# Altium project LW.PrjPcb
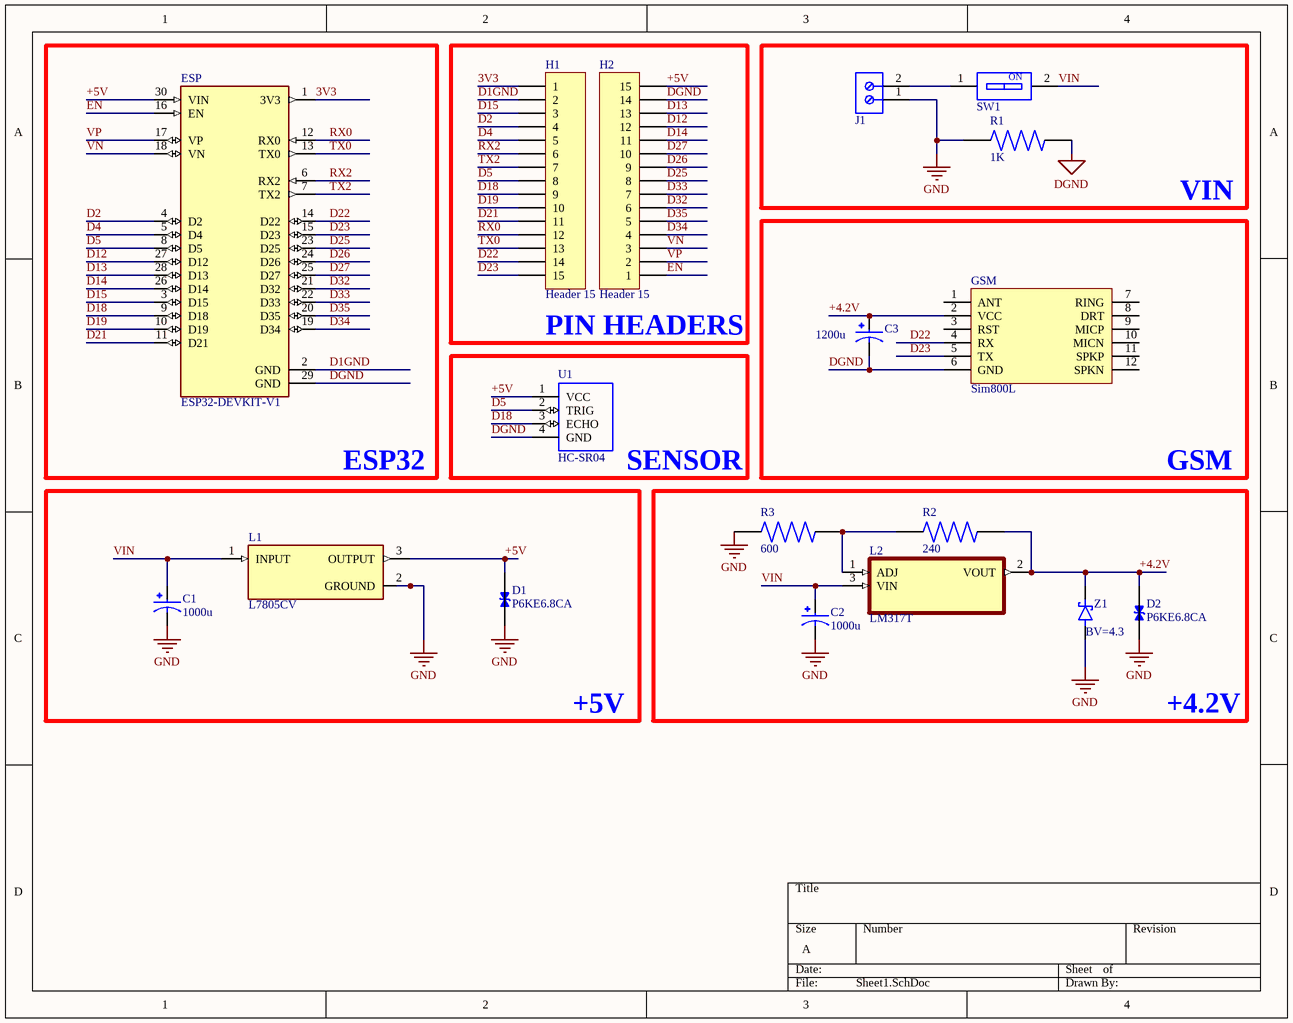
[diagram p0: Sheet1.SchDoc]
1 sheet, 18 parts. Net scope: global (net labels, ports and power ports of the same name join across sheets).
Board file: PCB1.PcbDoc

## Sheet Sheet1.SchDoc
size A; SheetNumber: 1; SheetTotal: 1

### Parts
C1  1000u  [CAPPRD500W60D1000H2000]
C2  1000u  [CAPPRD500W60D1000H2000]
C3  1200u  [CAPPRD500W60D1000H2000]
D1  P6KE6.8CA  [DIOAD1300W80L670D310]
D2  P6KE6.8CA  [DIOAD1300W80L670D310]
ESP  ESP32-DEVKIT-V1  [MODULE_ESP32_DEVKIT_V1]
GSM  Sim800L  [Sim800L]
H1  Header 15  [HDR1X15]
H2  Header 15  [HDR1X15]
J1  691101710002  [691101710002]  (value not drawn)
L1  L7805CV  [TO255P1040X460X1968-3]
L2  LM317T  [TO254P1054X470X1955-3]
R1  1K  [RESAD700W45L350D185]
R2  240  [RESAD700W45L350D185]
R3  600  [RESAD700W45L350D185]
SW1  418117170901  [418117170901]  (value not drawn)
U1  HC-SR04  [XCVR_HC-SR04]
Z1  BV=4.3  [DIOAD1036W78L463D272]

### Blocks framed on the sheet
ESP32: ESP
PIN HEADERS: H1 H2
VIN: J1 R1 SW1
GSM: C3 GSM
+4.2V: C2 D2 L2 R2 R3 Z1

### Nets
DGND: C3.N ESP.29(GND) GSM.6(GND) H2.14 R1.2 U1.4(GND)
GND: C1.N C2.N D1.1 D2.1 J1.1 L1.2(GROUND) R1.1 R3.1 Z1.2(A)
3V3: ESP.1(3V3) H1.1
+4.2V: C3.P D2.2 GSM.2(VCC) L2.2(VOUT) R2.2 Z1.1(K)
+5V: D1.2 ESP.30(VIN) H2.15 L1.3(OUTPUT) U1.1(VCC)
D1GND: ESP.2(GND) H1.2
D2: ESP.4(D2) H1.4
D4: ESP.5(D4) H1.5
D5: ESP.8(D5) H1.8 U1.2(TRIG)
D12: ESP.27(D12) H2.12
D13: ESP.28(D13) H2.13
D14: ESP.26(D14) H2.11
D15: ESP.3(D15) H1.3
D18: ESP.9(D18) H1.9 U1.3(ECHO)
D19: ESP.10(D19) H1.10
D21: ESP.11(D21) H1.11
D22: ESP.14(D22) GSM.4(RX) H1.14
D23: ESP.15(D23) GSM.5(TX) H1.15
D25: ESP.23(D25) H2.8
D26: ESP.24(D26) H2.9
D27: ESP.25(D27) H2.10
D32: ESP.21(D32) H2.6
D33: ESP.22(D33) H2.7
D34: ESP.19(D34) H2.4
D35: ESP.20(D35) H2.5
EN: ESP.16(EN) H2.1
RX0: ESP.12(RX0) H1.12
RX2: ESP.6(RX2) H1.6
TX0: ESP.13(TX0) H1.13
TX2: ESP.7(TX2) H1.7
VIN: C1.P C2.P L1.1(INPUT) L2.3(VIN) SW1.2
VN: ESP.18(VN) H2.3
VP: ESP.17(VP) H2.2
NetJ1_2: J1.2 SW1.1
NetL2_1: L2.1(ADJ) R2.1 R3.2

Not connected (* = marked no-connect by the designer): GSM 1(ANT) 3(RST) 7(RING) 8(DRT) 9(MICP) 10(MICN) 11(SPKP) 12(SPKN)

### Notes on the sheet
- SENSOR
- +5V
- (in symbol 418117170901) ON

### Library data of the parts
C1-C3 = EEUFR1E102: 1000F 25V Aluminum Electrolytic Capacitors Radial, Can 10000 Hrs @ 105C; MP: EEU-FR1E102; MF: Panasonic; Package: RADIAL-2 Panasonic; SnapEDA_Link: https://www.snapeda.com/parts/EEU-FR1E102/Panasonic/view-part/630528/?ref=snap; Value: *; Availability: In Stock; Purchase-URL: https://pricing.snapeda.com/search/part/EEU-FR1E102/?ref=eda; Price: None; Check_prices: https://www.snapeda.com/parts/EEU-FR1E102/Panasonic/view-part/630528/?ref=eda
D1 D2 = P6KE6.8CA: 600W, 6.8V, 5%, Bidirectional, TVS; MF: Taiwan Semiconductor; SnapEDA_Link: https://www.snapeda.com/parts/P6KE6.8CA/Taiwan+Semiconductor/view-part/?ref=snap; Package: DO-15 Taiwan Semiconductor; Value: *; MP: P6KE6.8CA; Check_prices: https://www.snapeda.com/parts/P6KE6.8CA/Taiwan+Semiconductor/view-part/?ref=eda
ESP = ESP32-DEVKIT-V1: Dual core, Wi-Fi: 2.4 GHz up to 150 Mbits/s,BLE (Bluetooth Low Energy) and legacy Bluetooth, 32 bits, Up to 240 MHz; MF: Do it; SnapEDA_Link: https://www.snapeda.com/parts/ESP32-DEVKIT-V1/Do+it/view-part/?ref=snap; Package: None; Value: *; MP: ESP32-DEVKIT-V1; Check_prices: https://www.snapeda.com/parts/ESP32-DEVKIT-V1/Do+it/view-part/?ref=eda
H1 H2 = Header 15: Header, 15-Pin; LatestRevisionDate: 17-Jul-2002; LatestRevisionNote: Re-released for DXP Platform.; Publisher: Altium Limited
J1 = 691101710002: WR-TBL Series 101 Horizontal Entry Modular, THT, pitch 5mm, 2p; Manufacturer: Wurth Elektronik; Modularity: Yes; Rated Current: 16A; Working Voltage: 250V; ComponentLink1Description: Website Link; ComponentLink1URL: https://www.we-online.com/redexpert/article/691101710002?ad; ComponentLink2Description: Datasheet Link; ComponentLink2URL: https://www.we-online.com/redexpert/spec/691101710002?ad; Manufacturer Part Number: 691101710002; Category: Terminal Blocks; Match Code: WR-TBL; Mount: Through Hole; Operating Temperature Max: 105°C; Operating Temperature Min: -40°C; Packaging: Box; Application: Pressure Clamp; Number of Pins: 2; Number of Rows: 1; Orientation: Horizontal; Pitch: 5mm
L1 = L7805CV: Linear Voltage Regulator IC Positive Fixed 1 Output 1.5A TO-220; MF: STMicroelectronics; SnapEDA_Link: https://www.snapeda.com/parts/L7805CV/STMicroelectronics/view-part/?ref=snap; Package: TO-220-3 STMicroelectronics; Value: *; MP: L7805CV; Check_prices: https://www.snapeda.com/parts/L7805CV/STMicroelectronics/view-part/?ref=eda
L2 = LM317T: Linear Voltage Regulator IC Positive Adjustable 1 Output 1.5A TO-220AB; MF: onsemi; SnapEDA_Link: https://www.snapeda.com/parts/LM317T/Onsemi/view-part/?ref=snap; Package: TO-220-3 ON; Value: *; MP: LM317T; Check_prices: https://www.snapeda.com/parts/LM317T/Onsemi/view-part/?ref=eda
R1-R3 = 3-1623927-1: 1 MOhms Â±5% 0.25W, 1/4W Through Hole Resistor Axial - Carbon Film; MF: TE Connectivity; SnapEDA_Link: https://www.snapeda.com/parts/3-1623927-1/TE+Connectivity/view-part/?ref=snap; Package: None; Value: *; MP: 3-1623927-1; Check_prices: https://www.snapeda.com/parts/3-1623927-1/TE+Connectivity/view-part/?ref=eda
SW1 = 418117170901: WS-DITV Compact THT Dip Switch, Flat Actuator, pitch 2.54mm, 1p; Manufacturer: Wurth Elektronik; Actuator Type: Flat Type; Operation Force: 800g; Rated Current Non-Switching: 100mA; Rated Current Switching: 25mA; Rated Voltage Non-Switching: 50VDC; Rated Voltage Switching: 24VDC; Number of Poles: 1; ComponentLink1Description: Website Link; ComponentLink1URL: https://www.we-online.com/redexpert/article/418117170901?ad; ComponentLink2Description: Datasheet Link; ComponentLink2URL: https://www.we-online.com/redexpert/spec/418117170901?ad; Manufacturer Part Number: 418117170901; Category: Dip Switches; Match Code: WS-DITV; Mount: Through Hole; Operating Temperature Max: 85°C; Operating Temperature Min: -40°C; Packaging: Tube; Contact Material: Copper Alloy; Contact Plating: Gold; Pitch: 2.54mm
U1 = HC-SR04: Ultrasonic Sensor Module; Availability: Unavailable; MP: HC-SR04; Value: *; Price: None; Package: None
Z1 = 1N4742A: Zener Diode 12 V 1 W Â±5% Through Hole DO-41; MF: ON; SnapEDA_Link: https://www.snapeda.com/parts/1N4742A/Onsemi/view-part/?ref=snap; Package: DO-41 ON Semiconductor; Value: *; MP: 1N4742A; Check_prices: https://www.snapeda.com/parts/1N4742A/Onsemi/view-part/?ref=eda